# EAGLE design piTCx-Power-HAT+ (EAGLE 9.6.2)
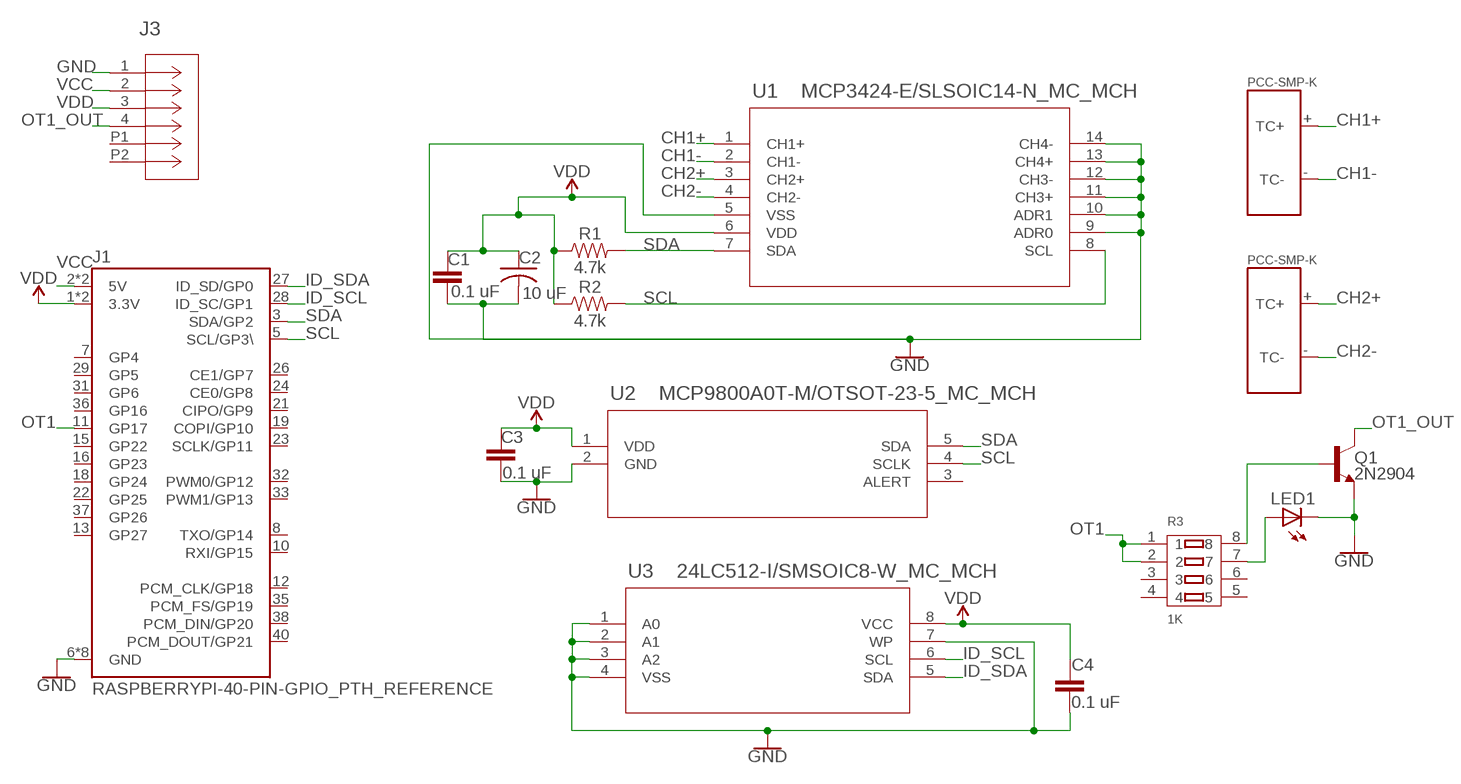
[diagram p0: schematic, sheet 1]

## Parts
C1  0.1 uF  CC0805KRX7R9BB104  [CAP_0805]
C2  10 uF  TAJB106K016RNJ  [CAP_TANT_B]
C3  0.1 uF  CC0805KRX7R9BB104  [CAP_0805]
C4  0.1 uF  CC0805KRX7R9BB104  [CAP_0805]
J1  RASPBERRYPI-40-PIN-GPIO_PTH_REFERENCE  [RASPBERRY_PI_HAT_40_PIN_PTH_WITH_REFERNCE]
J3  436500414CON_436500414  [CON_436500414]
LED1  LEDCHIP-LED0805  [CHIP-LED0805]
Q1  2N2904  TRANS_NPN-MMBTA42  [SOT23-3]
R1  4.7k  4.7KOHM-0603-1/10W-1%  [0603]
R2  4.7k  4.7KOHM-0603-1/10W-1%  [0603]
R3  1K  SMD-RES-ARRAY-1K-4R(RA1206-8)  [RA1206-8]
U1  MCP3424-E/SLSOIC14-N_MC_MCH  [SOIC14-N_MC_MCH]
U2  MCP9800A0T-M/OTSOT-23-5_MC_MCH  [SOT-23-5_MC_MCH]
U3  24LC512-I/SMSOIC8-W_MC_MCH  [SOIC8-W_MC_MCH]
U$1  THERMOCOUPLECONN-PCC-SMP-K  [THERMOCOUPLECONN-PCC-SMP-K]
U$2  THERMOCOUPLECONN-PCC-SMP-K  [THERMOCOUPLECONN-PCC-SMP-K]

## Nets
CH1+: U1.1(CH1+) U$1.+(TC+)
CH1-: U1.2(CH1-) U$1.-(TC-)
CH2+: U1.3(CH2+) U$2.+(TC+)
CH2-: U1.4(CH2-) U$2.-(TC-)
GND: C1.2 C2.2 C3.2 C4.2 J1.6(GND) J1.9(GND) J1.14(GND) J1.20(GND) J1.25(GND) J1.30(GND) J1.34(GND) J1.39(GND) J3.1 LED1.C Q1.2(E) U1.5(VSS) U1.9(ADR0) U1.10(ADR1) U1.11(CH3+) U1.12(CH3-) U1.13(CH4+) U1.14(CH4-) U2.2(GND) U3.1(A0) U3.2(A1) U3.3(A2) U3.4(VSS) U3.7(WP)
ID_SCL: J1.28(ID_SC/GP1) U3.6(SCL)
ID_SDA: J1.27(ID_SD/GP0) U3.5(SDA)
N$2: Q1.1(B) R3.8
N$3: LED1.A R3.7
OT1: J1.11(GP17) R3.1 R3.2
OT1_OUT: J3.4 Q1.3(C)
SCL: J1.5(SCL/GP3\) R2.2 U1.8(SCL) U2.4(SCLK)
SDA: J1.3(SDA/GP2) R1.2 U1.7(SDA) U2.5(SDA)
VCC: J1.2(5V) J1.4(5V) J3.2
VDD: C1.1 C2.1 C3.1 C4.1 J1.1(3.3V) J1.17(3.3V) J3.3 R1.1 R2.1 U1.6(VDD) U2.1(VDD) U3.8(VCC)
Unconnected: J1.7(GP4) J1.8(TXO/GP14) J1.10(RXI/GP15) J1.12(PCM_CLK/GP18) J1.13(GP27) J1.15(GP22) J1.16(GP23) J1.18(GP24) J1.19(COPI/GP10) J1.21(CIPO/GP9) J1.22(GP25) J1.23(SCLK/GP11) J1.24(CE0/GP8) J1.26(CE1/GP7) J1.29(GP5) J1.31(GP6) J1.32(PWM0/GP12) J1.33(PWM1/GP13) J1.35(PCM_FS/GP19) J1.36(GP16) J1.37(GP26) J1.38(PCM_DIN/GP20) J1.40(PCM_DOUT/GP21) J3.P1 J3.P2 R3.3 R3.4 R3.5 R3.6 U2.3(ALERT)

## Library data of the parts
C1 C3 C4 = Resistor_Capacitor:CC0805KRX7R9BB104: CAP CER 0.1UF 50V X7R 0805 Manufacturer's datasheet <http://www.yageo.com/documents/recent/UPY-GPHC_X7R_6.3V-to-50V_18.pdf>; CREATED_BY: PCBLayout.com; DIGIKEY_PART_NUMBER: 311-1140-2-ND; MANUFACTURER: Yageo; MPN: CC0805KRX7R9BB104; PACKAGE: SMD 0805
C2 = Resistor_Capacitor:TAJB106K016RNJ: CAP TANT 10UF 10% 16V 1411 Manufacturer's datasheet <http://datasheets.avx.com/TAJ.pdf>; CREATED_BY: PCBLayout.com; DIGIKEY_PART_NUMBER: 478-1673-2-ND; MANUFACTURER: AVX Corporation; MPN: T494A106M020AT; PACKAGE: CAP TANT B
J1 = Raspi-Hat:RASPBERRYPI-40-PIN-GPIO: Raspberry Pi GPIO Header 2x20 pin connector, as found on B, B+, A+ models. Both shrouded PTH and SMT versions available. SparkFun Products: GPIO Shrouded Header <https://www.sparkfun.com/products/13054>- PTH SparkFun Pi Wedge (Preassembled) <https://www.sparkfun.com/products/13717>
J3 = 436500414:436500414; COPYRIGHT: Copyright (C) 2024 Ultra Librarian. All rights reserved.; MANUFACTURER_PART_NUMBER: 436500414; MFR_NAME: Molex Connector Corporation
LED1 = adafruit:LED: LED OSRAM: - CHIPLED LG R971, LG N971, LY N971, LG Q971, LY Q971, LO R971, LY R971 LH N974, LH R974 LS Q976, LO Q976, LY Q976 LO Q996 - Hyper CHIPLED LW Q18S LB Q993, LB Q99A, LB R99A - SideLED LS A670, LO A670, LY A670, LG A670, LP A670 LB A673, LV A673, LT A673, LW A673 LH A674 LY A675 LS A676, LA A676, LO A676, LY A676, LW A676 LS A679, LY A679, LG A679 - Hyper Micro SIDELED® LS Y876, LA Y876, LO Y876, LY Y876 LT Y87S - SmartLED LW L88C, LW L88S LB L89C, LB L89S, LG L890 LS L89K, LO L89K, LY L89K LS L896, LA L896, LO L896, LY L896 - TOPLED LS T670, LO T670, LY T670, LG T670, LP T670 LSG T670, LSP T670, LSY T670, LOP T670, LYG T670 LG T671, LOG T671, LSG T671 LB T673, LV T673, LT T673, LW T673 LH T674 LS T676, LA T676, LO T676, LY T676, LB T676, LH T676, LSB T676, LW T676 LB T67C, LV T67C, LT T67C, LS T67K, LO T67K, LY T67K, LW E67C LS E67B, LA E67B, LO E67B, LY E67B, LB E67C, LV E67C, LT E67C LW T67C LS T679, LY T679, LG T679 LS T770, LO T770, LY T770, LG T770, LP T770 LB T773, LV T773, LT T773, LW T773 LH T774 LS E675, LA E675, LY E675, LS T675 LS T776, LA T776, LO T776, LY T776, LB T776 LHGB T686 LT T68C, LB T68C - Hyper Mini TOPLED® LB M676 - Mini TOPLED Santana® LG M470 LS M47K, LO M47K, LY M47K Source: http://www.osram.convergy.de/
Q1 = SparkFun-DiscreteSemi:TRANS_NPN: NPN transistor Current controlled devices typically used to amplify current or used as a switch. BC547 - COM-08928 <http://www.sparkfun.com/products/8928> (TO-92 45V 100mA) (1.Collector 2.Base 3.Emitter) 2N3904 - COM-00521 <http://www.sparkfun.com/products/521> (TO-92 40V 200mA) (1.Emitter 2.Base 3.Collector) P2N2222A - COM-12852 <http://www.sparkfun.com/products/12852> (TO-92 40V 600mA) (1.Collector 2.Base 3.Emitter); PROD_ID: TRANS-09116; VALUE: 500mA/300V
R1 R2 = SparkFun-Resistors:4.7KOHM: 4.7kΩ resistor A resistor is a passive two-terminal electrical component that implements electrical resistance as a circuit element. Resistors act to reduce current flow, and, at the same time, act to lower voltage levels within circuits. - Wikipedia; PROD_ID: RES-07857
R3 = OPL_Resistor:SMD-RES-ARRAY-1K-4R(RA1206-8): 301030012; MPN: Chip-Array-Series-1%
U1 = MCP3424:MCP3424-E/SL; COPYRIGHT: Copyright (C) 2023 Ultra Librarian. All rights reserved.; MANUFACTURER_PART_NUMBER: MCP3424-E/SL; MFR_NAME: Microchip
U2 = MCP9800:MCP9800A0T-M/OT; COPYRIGHT: Copyright (C) 2023 Ultra Librarian. All rights reserved.; MANUFACTURER_PART_NUMBER: MCP9800A0T-M/OT; MFR_NAME: Microchip
U3 = 24LC512_I_SM:24LC512-I/SM; COPYRIGHT: Copyright (C) 2023 Ultra Librarian. All rights reserved.; MANUFACTURER_PART_NUMBER: 24LC512-I/SM; MFR_NAME: Microchip
U$1 U$2 = PCC_SMP_V_K:THERMOCOUPLECONN-PCC-SMP-K: THERMOCOUPLE CONN - PCC-SMP-K

## Board
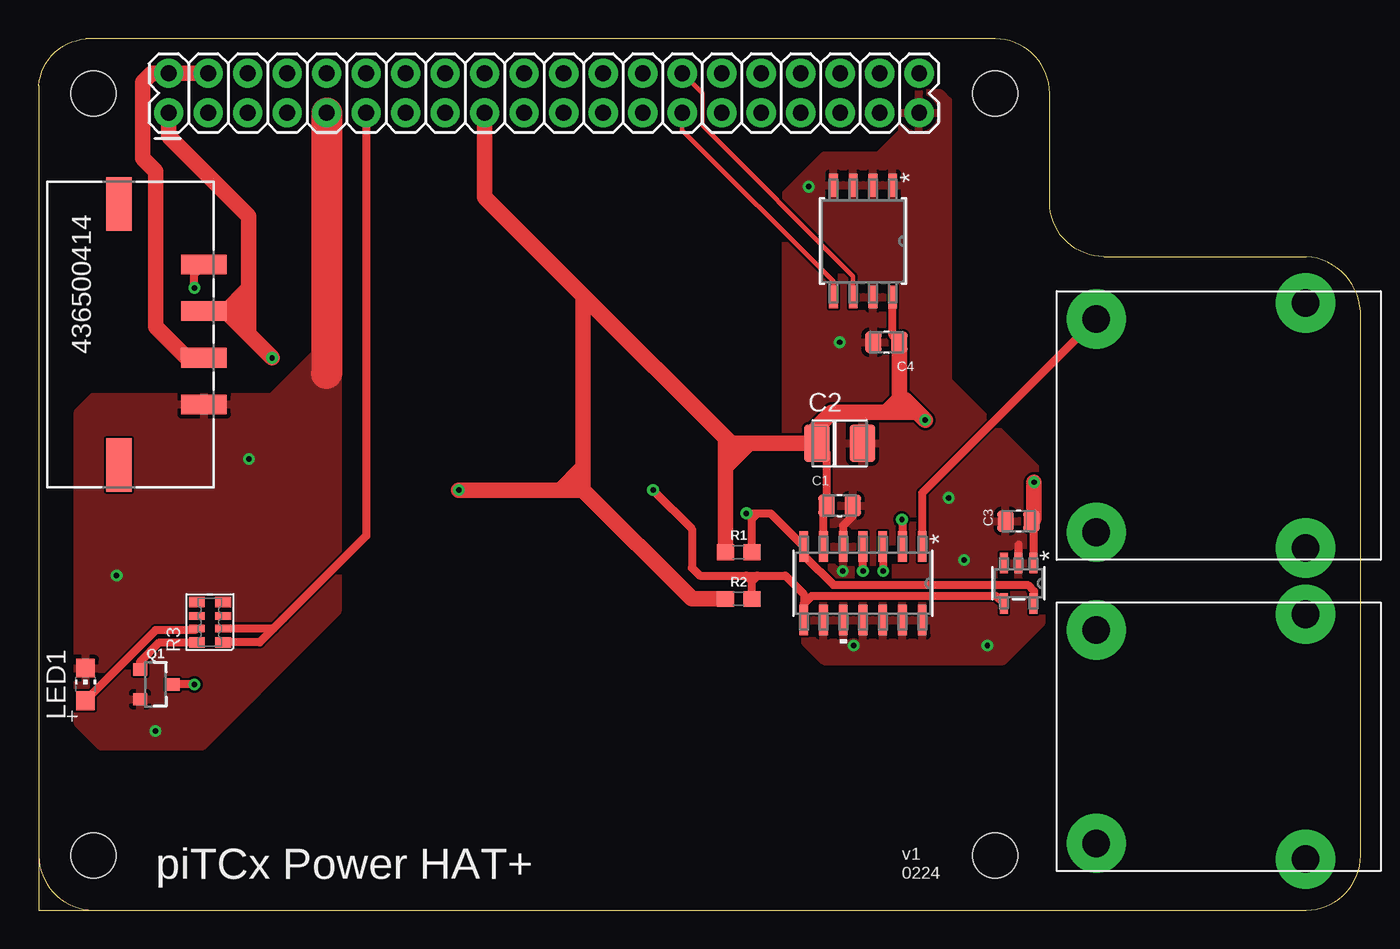
[diagram p1: board, top side]
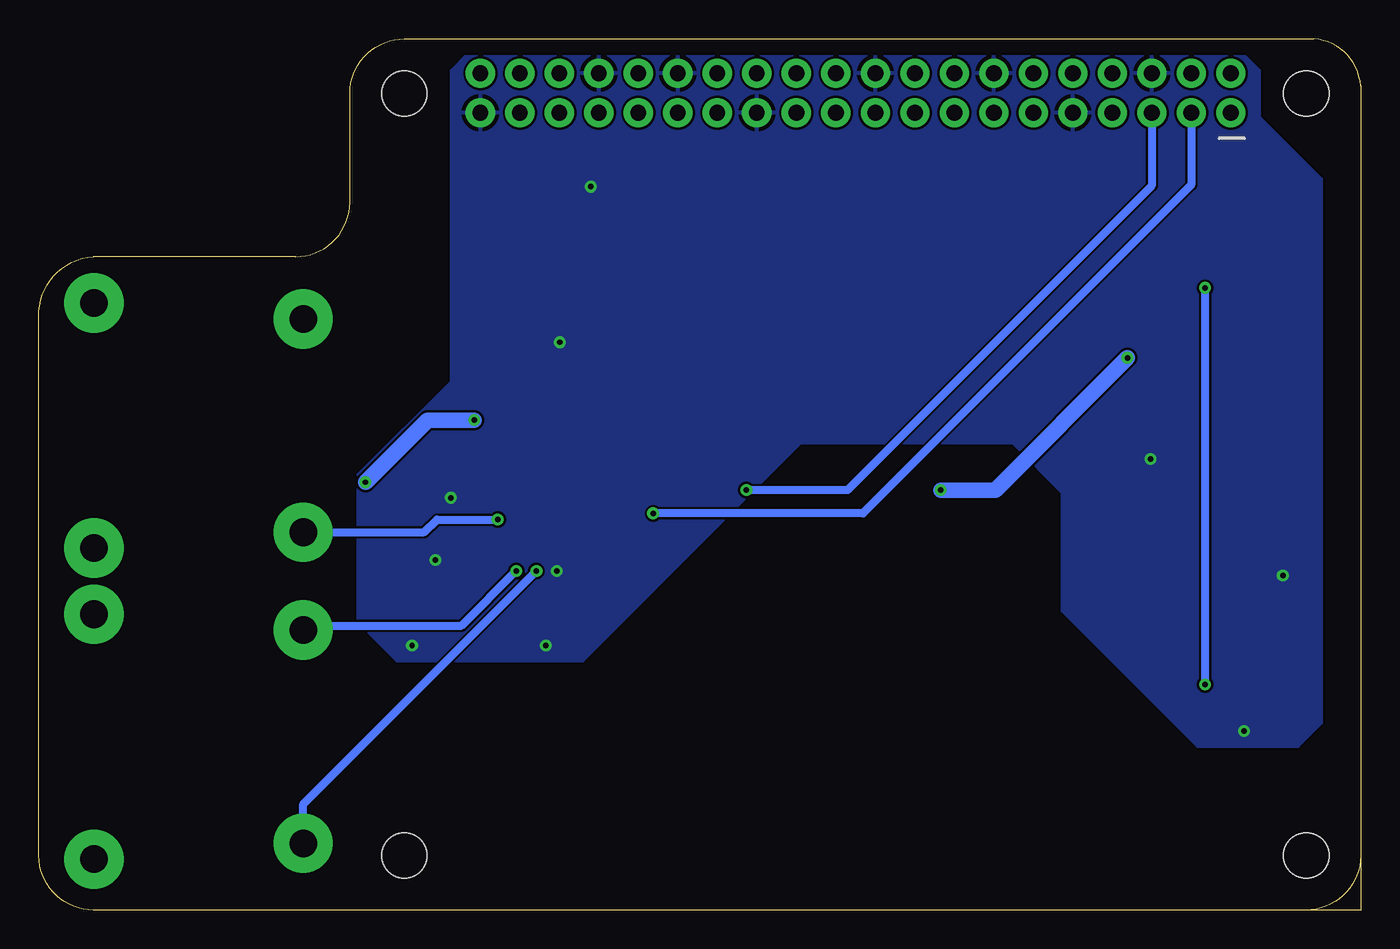
[diagram p2: board, bottom side, seen from below]

Size 85 x 56 mm. Coordinates in mm from the lower left corner, seen from the top.
Outline: 3.5,0 0,0 0,3.5
Outline: 3.5,0 81.5,0 arc90 85,3.5 85,38.5 arc82 81.5,42 68.5,42 arc-90 65,45.5 65,52.5 arc90 61.5,56 3,56 arc81 0,53 0,3.5
Outline: 0,3.5 arc90 3.5,0
Copper layers (1*16): Top 0.035mm / dielectric 1.5mm / Bottom 0.035mm
Design rules "default": minimum track width 6mil, minimum drill 0.35mm, track to track 6mil, track to pad 6mil, pad to pad 6mil, via to via 6mil, smd to smd 6mil, copper to edge 40mil, drill to drill 6mil, minimum pad ring 10mil, minimum via ring 8mil, stop-mask expansion 4mil, vias tented up to drill 0mil, thermal gap 10mil

### Footprints (pad centres in the part's own frame; a part is rotated, then mirrored left to right if it is on the bottom)
CAP_0805 = smd 1.05 x 1.38: 1 -0.84,0; 2 0.84,0
CAP_TANT_B = smd 1.66 x 2.42: 1 -1.475,0; 2 1.475,0
RASPBERRY_PI_HAT_40_PIN_PTH_WITH_REFERNCE = drill 1.016 pad 1.88: 1 8.35,51.25; 2 8.35,53.79; 3 10.89,51.25; 4 10.89,53.79; 5 13.43,51.25; 6 13.43,53.79; 7 15.97,51.25; 8 15.97,53.79; 9 18.51,51.25; 10 18.51,53.79; 11 21.05,51.25; 12 21.05,53.79; 13 23.59,51.25; 14 23.59,53.79; 15 26.13,51.25; 16 26.13,53.79; 17 28.67,51.25; 18 28.67,53.79; 19 31.21,51.25; 20 31.21,53.79; 21 33.75,51.25; 22 33.75,53.79; 23 36.29,51.25; 24 36.29,53.79; 25 38.83,51.25; 26 38.83,53.79; 27 41.37,51.25; 28 41.37,53.79; 29 43.91,51.25; 30 43.91,53.79; 31 46.45,51.25; 32 46.45,53.79; 33 48.99,51.25; 34 48.99,53.79; 35 51.53,51.25; 36 51.53,53.79; 37 54.07,51.25; 38 54.07,53.79; 39 56.61,51.25; 40 56.61,53.79 | hole 2.9: 3.5,3.5; 61.5,3.5; 61.5,52.5; 3.5,52.5
CON_436500414 = smd 1.27 x 2.92: 1 4.5,5.12; 2 1.5,5.12; 3 -1.5,5.12; 4 -4.5,5.12 | smd 3.43 x 1.65: P1 8.385,-0.35; P2 -8.385,-0.35
CHIP-LED0805 = smd 1.2 x 1.2: A 0,-1.05; C 0,1.05
SOT23-3 = smd 0.8 x 0.9: 1 -0.95,-1; 2 0.95,-1; 3 0,1.1
0603 = smd 1.1 x 1: 1 -0.85,0; 2 0.85,0
RA1206-8 = smd 0.7 x 1: 1 -1.3,-0.85; 4 1.3,-0.85; 5 1.3,0.85; 8 -1.3,0.85 | smd 0.5 x 1: 2 -0.4,-0.85; 3 0.4,-0.85; 6 0.4,0.85; 7 -0.4,0.85
SOIC14-N_MC_MCH = smd 1.981 x 0.559: 1 -2.362,3.81; 2 -2.362,2.54; 3 -2.362,1.27; 4 -2.362,0; 5 -2.362,-1.27; 6 -2.362,-2.54; 7 -2.362,-3.81; 8 2.362,-3.81; 9 2.362,-2.54; 10 2.362,-1.27; 11 2.362,0; 12 2.362,1.27; 13 2.362,2.54; 14 2.362,3.81
SOT-23-5_MC_MCH = smd 1.321 x 0.508: 1 -1.295,0.95; 2 -1.295,0; 3 -1.295,-0.95; 4 1.295,-0.95; 5 1.295,0.95
SOIC8-W_MC_MCH = smd 1.473 x 0.559: 1 -3.594,1.905; 2 -3.594,0.635; 3 -3.594,-0.635; 4 -3.594,-1.905; 5 3.594,-1.905; 6 3.594,-0.635; 7 3.594,0.635; 8 3.594,1.905
THERMOCOUPLECONN-PCC-SMP-K = drill 1.778 pad 3.81: + 0,0; - 13.716,0; P$3 -1.016,13.462; P$4 14.732,13.462

### Placement (x,y rotation side)
C1  51.5,26 0 top
C2  51.5,30 0 top
C3  63,25 180 top
C4  54.5,36.5 180 top
J1  0,0 0 top
J3  5.5,37 270 top
LED1  3,14.5 0 top
Q1  7.5,14.5 270 top
R1  45,23 0 top
R2  45,20 0 top
R3  11,18.5 90 top
U1  53,21 270 top
U2  63,21 270 top
U3  53,43 270 top
U$1  68,38 270 top
U$2  68,18 270 top

### Tracks (layer width: path | path; a pad name or v marks a point on that pad's centre or on a via)
CH1+
  Top 0.5: U$1.+ 56.81,26.81 U1.1
CH1-  (via drill 0.35)
  Top 0.5: v55.5,25.1 55.54,25.06 U1.2
  Bottom 0.5: U$1.- 60.22,24.28 59.4,25.1 v55.5,25.1
CH2+  (via drill 0.35)
  Top 0.5: v54.3,21.8 54.3,23.33 U1.3
  Bottom 0.5: U$2.+ 67.72,18.28 57.82,18.28 v54.3,21.8
CH2-  (via drill 0.35)
  Top 0.5: v53,21.8 U1.4
  Bottom 0.5: U$2.- 68,6.8 v53,21.8
GND  (via drill 0.35)
  Top 0.5: 63,23.5 U2.2 | U1.5 51.73,24.73 52.34,25.34 C1.2
  Top 2: J1.9 18.51,34.51 18.5,34.5
  other vias: 49.5,46.5 51.5,36.5 58.5,26.5 61,17 52.4,17 5,21.5 13.5,29 7.5,11.5 51.7,21.8 59.5,22.5
  pour Bottom: 7.5,55 57.5,55 58.5,54 58.5,34 64.5,28 64.5,18.5 62,16 50,16 36,30 22.4,30 19.2,26.8 19.2,19.2 10.5,10.5 4,10.5 2.5,12 2.5,47 6.5,51 6.5,54
  pour Top: 62,16 64.5,18.5 64.5,28 58.5,34 58.5,52 58,52.5 56,52.5 55.5,52 55.5,50 54,48.5 50.5,48.5 48,46 48,18.5 50.5,16
  pour Top: 19.2,19.2 10.5,10.5 4,10.5 2.5,12 2.5,32 3.5,33 15,33 17.7,35.7 19.2,35.7
ID_SCL
  Top 0.3: J1.28 42.67,52.49 42.67,50.44 52.37,40.74 U3.6
ID_SDA
  Top 0.3: J1.27 41.37,50.13 51.09,40.41 U3.5
  Top 0.5: U3.5
N$2
  Top 0.5: Q1.1 6.5,15.95 7.75,17.2 R3.8
N$3
  Top 0.5: R3.7 10.05,18 7.5,18 3,13.5 LED1.A
OT1
  Top 0.5: J1.11 21.05,24.05 15.75,18.75 15.1,18.1 | 15.1,18.1 14.2,17.2 R3.1 | R3.2 15.1,18.1
OT1_OUT  (via drill 0.35)
  Top 0.5: v10,14.5 Q1.3 | 10.02,40.02 v10,40 10,40.88 J3.4
  Bottom 0.5: v10,14.5 v10,40
SCL  (via drill 0.35)
  Top 0.5: v39.5,27 42,24.5 42,22 42.5,21.5 45.5,21.5 | 45.5,21.5 46.2,21.5 | 46.2,21.5 48,21.5 49.19,20.31 U1.8 49.19,19.69 49.7,20.2 61.55,20.2 U2.4 | 45.85,21.15 45.5,21.5 | R2.2 45.85,21.15 | 45.85,21.15 46.2,21.5
  Bottom 0.5: J1.5 13.43,46.57 33,27 v39.5,27
SDA  (via drill 0.35)
  Top 0.5: 46.2,25.5 47.05,25.5 U1.7 49.28,23.27 49.28,22.7 51.08,20.9 63.6,20.9 64,20.5 64,19.75 U2.5 | 45.85,25.15 46.2,25.5 | R1.2 45.85,25.15 | 45.85,25.15 v45.5,25.5 46.2,25.5
  Bottom 0.5: J1.3 10.89,46.61 32,25.5 v45.5,25.5
VCC
  Top 1: J1.4 J1.2 7.26,53.79 6.67,53.2 6.67,48.33 7.5,47.5 7.5,37.5 9.5,35.5 J3.2
VDD  (via drill 0.35)
  Top 0.5: C3.1 63.95,24.89 U2.1 | C2.1 50.66,29.36 C1.1 50.46,25.8 U1.6 | C4.1 54.91,36.94 U3.8
  Top 1: J1.17 28.67,45.83 35,39.5 | 54.5,32 51,32 50.02,31.02 C2.1 45.65,30 | 54.5,32 55.34,32.84 | 55.34,32.84 C4.1 | J1.1 8.35,49.75 13.5,44.6 13.5,40 | 13.5,40 13.5,38.5 | 13.5,38.5 13.5,37 | 45.65,30 44.5,30 | 35,39.5 44.25,30.25 | 44.25,30.25 44.5,30 | 55.34,32.84 55.66,32.84 56.5,32 | 56.5,32 v57,31.5 | v64,27.5 64,25.16 C3.1 | 44.5,30 44.15,29.65 | 44.15,29.65 44.15,28.5 | 44.15,28.5 R1.1 | 44.15,29.65 44.15,30.15 44.25,30.25 | 35,39.5 35,28.5 | 35,28.5 35,27 | 35,27 42,20 R2.1 | v15,35.5 13.5,37 | v27,27 33.5,27 | 33.5,27 35,27 | 12,38.5 13.5,37 | 12,38.5 J3.3 13.5,38.5 | 12,38.5 13.5,40 | 44.15,28.5 45.65,30 | 33.5,27 35,28.5 | 54.5,32 56.5,32
  Bottom 1: v57,31.5 60,31.5 v64,27.5 | v27,27 23.5,27 v15,35.5

### Text on the board
tPlace: piTCx Power HAT+ | v1 / 0224